# EAGLE design BigBus_Error (EAGLE 7.7.0)
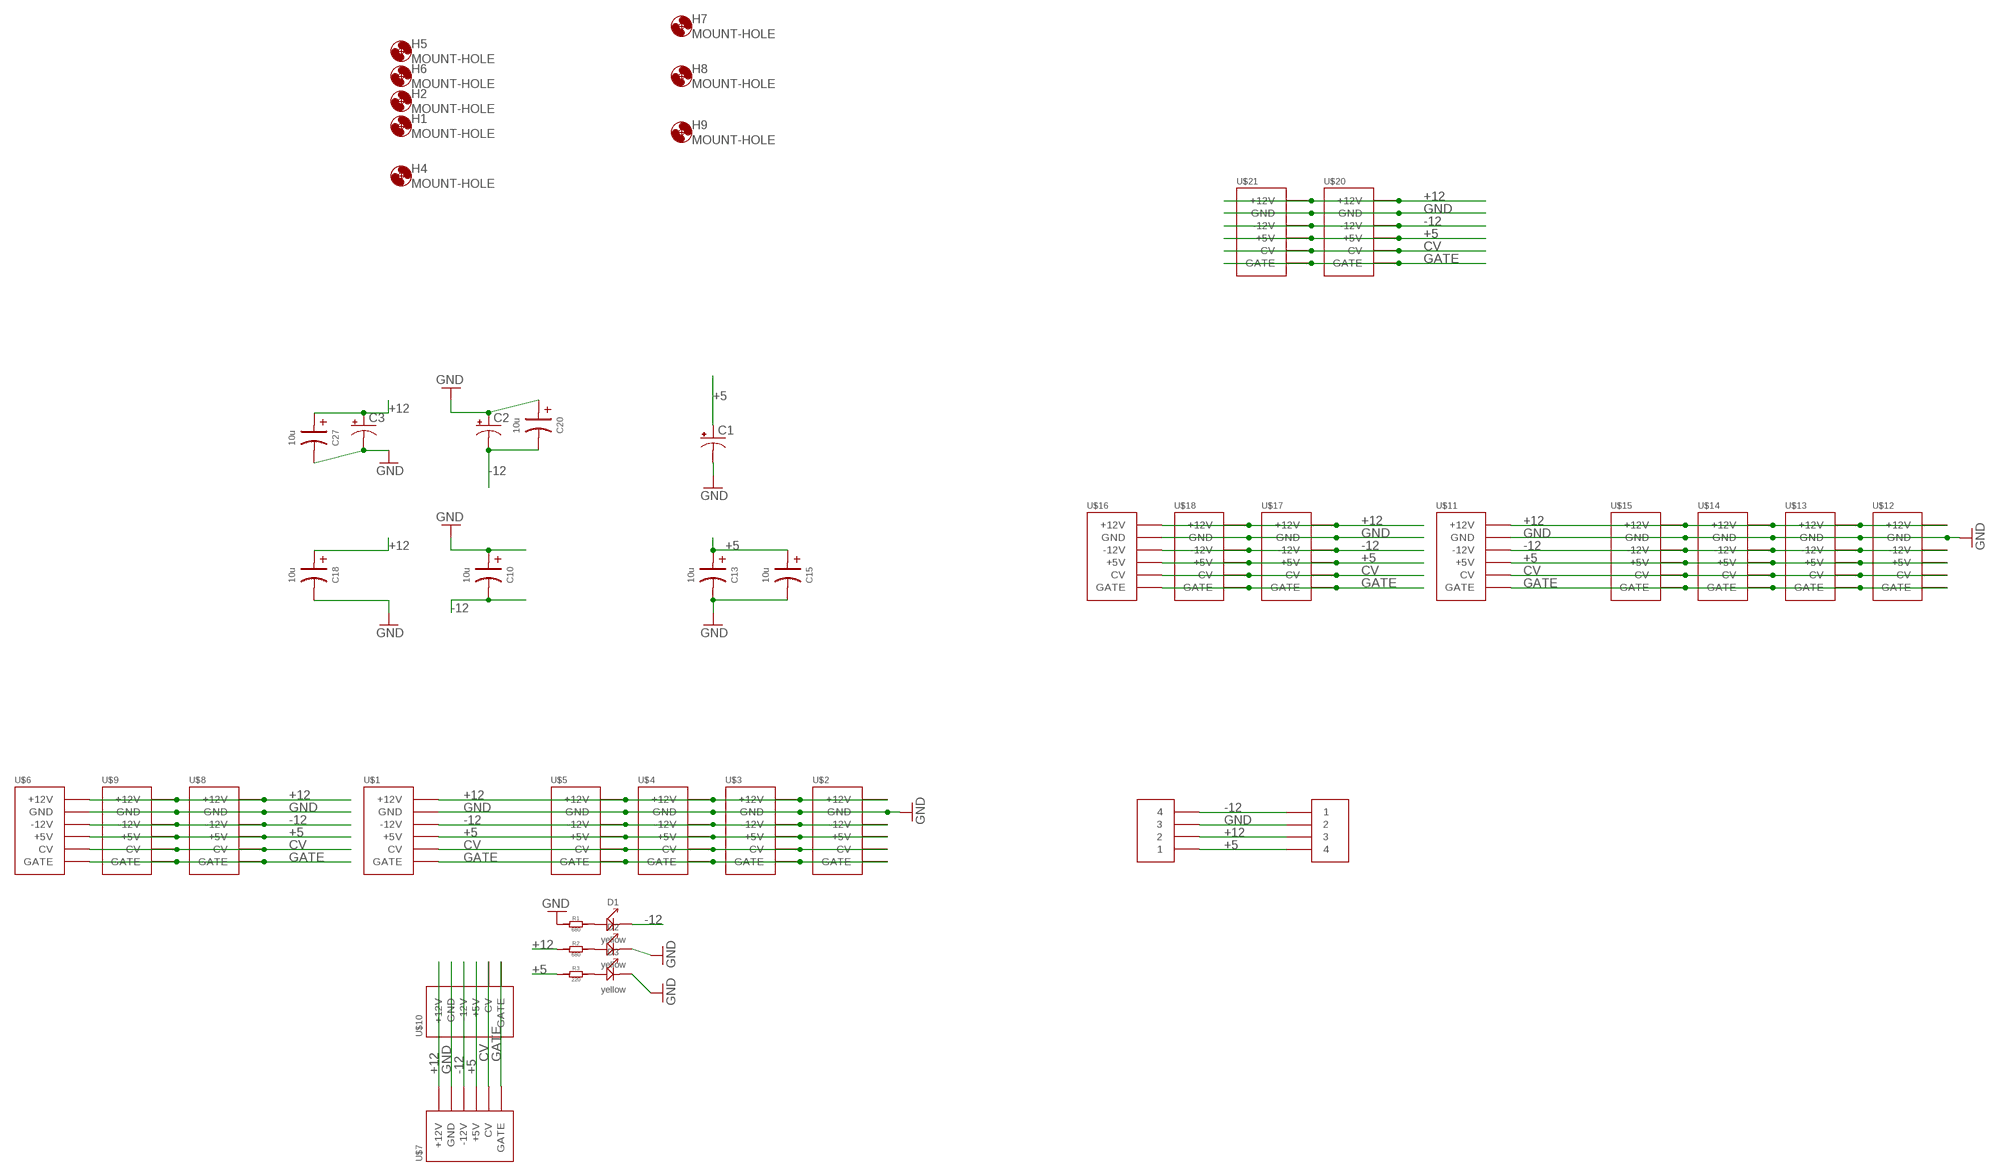
[diagram p0: schematic, sheet 1]

## Parts
C1  CAP_POLD  [PANASONIC_D]
C2  CAP_POLD  [PANASONIC_D]
C3  CAP_POLD  [PANASONIC_D]
C10  10u  C-POLAR-A  [AVX-A]
C13  10u  C-POLAR-A  [AVX-A]
C15  10u  C-POLAR-A  [AVX-A]
C18  10u  C-POLAR-A  [AVX-A]
C20  10u  C-POLAR-A  [AVX-A]
C27  10u  C-POLAR-A  [AVX-A]
D1  yellow  LED  [LED0603]
D2  yellow  LED  [LED0603]
D3  yellow  LED  [LED0603]
H1  MOUNT-HOLE  [3.2-NOMARKINGS-SMALLSAFEZONE]
H2  MOUNT-HOLE  [3.2-NOMARKINGS-SMALLSAFEZONE]
H4  MOUNT-HOLE  [3.2-NOMARKINGS-SMALLSAFEZONE]
H5  MOUNT-HOLE  [3.2-NOMARKINGS-SMALLSAFEZONE]
H6  MOUNT-HOLE  [3.2-NOMARKINGS-SMALLSAFEZONE]
H7  MOUNT-HOLE  [3.2-NOMARKINGS-SMALLSAFEZONE]
H8  MOUNT-HOLE  [3.2-NOMARKINGS-SMALLSAFEZONE]
H9  MOUNT-HOLE  [3.2-NOMARKINGS-SMALLSAFEZONE]
R1  680  R-0603  [R0603]
R2  680  R-0603  [R0603]
R3  220  R-0603  [R0603]
U$1  POWER_SHROUDED_NOTEXT  [POWER_16_SHROUDED_NOTEXT]
U$2  POWER_SHROUDED_NOTEXT  [POWER_16_SHROUDED_NOTEXT]
U$3  POWER_SHROUDED_NOTEXT  [POWER_16_SHROUDED_NOTEXT]
U$4  POWER_SHROUDED_NOTEXT  [POWER_16_SHROUDED_NOTEXT]
U$5  POWER_SHROUDED_NOTEXT  [POWER_16_SHROUDED_NOTEXT]
U$6  POWER_SHROUDED_NOTEXT  [POWER_16_SHROUDED_NOTEXT]
U$7  POWER_SHROUDED_NOTEXT  [POWER_16_SHROUDED_NOTEXT]
U$8  POWER_SHROUDED_NOTEXT  [POWER_16_SHROUDED_NOTEXT]
U$9  POWER_SHROUDED_NOTEXT  [POWER_16_SHROUDED_NOTEXT]
U$10  POWER_SHROUDED_NOTEXT  [POWER_16_SHROUDED_NOTEXT]
U$11  POWER_SHROUDED_NOTEXT  [POWER_16_SHROUDED_NOTEXT]
U$12  POWER_SHROUDED_NOTEXT  [POWER_16_SHROUDED_NOTEXT]
U$13  POWER_SHROUDED_NOTEXT  [POWER_16_SHROUDED_NOTEXT]
U$14  POWER_SHROUDED_NOTEXT  [POWER_16_SHROUDED_NOTEXT]
U$15  POWER_SHROUDED_NOTEXT  [POWER_16_SHROUDED_NOTEXT]
U$16  POWER_SHROUDED_NOTEXT  [POWER_16_SHROUDED_NOTEXT]
U$17  POWER_SHROUDED_NOTEXT  [POWER_16_SHROUDED_NOTEXT]
U$18  POWER_SHROUDED_NOTEXT  [POWER_16_SHROUDED_NOTEXT]
U$19  4PIN5MM  [4PIN5MM]
U$20  POWER_SHROUDED_NOTEXT  [POWER_16_SHROUDED_NOTEXT]
U$21  POWER_SHROUDED_NOTEXT  [POWER_16_SHROUDED_NOTEXT]
U$22  4PIN5MM  [4PIN5MM]

## Nets
+5: C1.+ C13.+ C15.+ R3.1 U$1.11(+5V) U$1.12(+5V) U$2.11(+5V) U$2.12(+5V) U$3.11(+5V) U$3.12(+5V) U$4.11(+5V) U$4.12(+5V) U$5.11(+5V) U$5.12(+5V) U$6.11(+5V) U$6.12(+5V) U$7.11(+5V) U$7.12(+5V) U$8.11(+5V) U$8.12(+5V) U$9.11(+5V) U$9.12(+5V) U$10.11(+5V) U$10.12(+5V) U$11.11(+5V) U$11.12(+5V) U$12.11(+5V) U$12.12(+5V) U$13.11(+5V) U$13.12(+5V) U$14.11(+5V) U$14.12(+5V) U$15.11(+5V) U$15.12(+5V) U$16.11(+5V) U$16.12(+5V) U$17.11(+5V) U$17.12(+5V) U$18.11(+5V) U$18.12(+5V) U$19.4 U$20.11(+5V) U$20.12(+5V) U$21.11(+5V) U$21.12(+5V) U$22.1
+12: C3.+ C18.+ C27.+ R2.1 U$1.9(+12V) U$1.10(+12V) U$2.9(+12V) U$2.10(+12V) U$3.9(+12V) U$3.10(+12V) U$4.9(+12V) U$4.10(+12V) U$5.9(+12V) U$5.10(+12V) U$6.9(+12V) U$6.10(+12V) U$7.9(+12V) U$7.10(+12V) U$8.9(+12V) U$8.10(+12V) U$9.9(+12V) U$9.10(+12V) U$10.9(+12V) U$10.10(+12V) U$11.9(+12V) U$11.10(+12V) U$12.9(+12V) U$12.10(+12V) U$13.9(+12V) U$13.10(+12V) U$14.9(+12V) U$14.10(+12V) U$15.9(+12V) U$15.10(+12V) U$16.9(+12V) U$16.10(+12V) U$17.9(+12V) U$17.10(+12V) U$18.9(+12V) U$18.10(+12V) U$19.3 U$20.9(+12V) U$20.10(+12V) U$21.9(+12V) U$21.10(+12V) U$22.2
-12: C2.- C10.- C20.- D1.- U$1.1(-12V) U$1.2(-12V) U$2.1(-12V) U$2.2(-12V) U$3.1(-12V) U$3.2(-12V) U$4.1(-12V) U$4.2(-12V) U$5.1(-12V) U$5.2(-12V) U$6.1(-12V) U$6.2(-12V) U$7.1(-12V) U$7.2(-12V) U$8.1(-12V) U$8.2(-12V) U$9.1(-12V) U$9.2(-12V) U$10.1(-12V) U$10.2(-12V) U$11.1(-12V) U$11.2(-12V) U$12.1(-12V) U$12.2(-12V) U$13.1(-12V) U$13.2(-12V) U$14.1(-12V) U$14.2(-12V) U$15.1(-12V) U$15.2(-12V) U$16.1(-12V) U$16.2(-12V) U$17.1(-12V) U$17.2(-12V) U$18.1(-12V) U$18.2(-12V) U$19.1 U$20.1(-12V) U$20.2(-12V) U$21.1(-12V) U$21.2(-12V) U$22.4
CV: U$1.13(CV) U$1.14(CV) U$2.13(CV) U$2.14(CV) U$3.13(CV) U$3.14(CV) U$4.13(CV) U$4.14(CV) U$5.13(CV) U$5.14(CV) U$6.13(CV) U$6.14(CV) U$7.13(CV) U$7.14(CV) U$8.13(CV) U$8.14(CV) U$9.13(CV) U$9.14(CV) U$10.13(CV) U$10.14(CV) U$11.13(CV) U$11.14(CV) U$12.13(CV) U$12.14(CV) U$13.13(CV) U$13.14(CV) U$14.13(CV) U$14.14(CV) U$15.13(CV) U$15.14(CV) U$16.13(CV) U$16.14(CV) U$17.13(CV) U$17.14(CV) U$18.13(CV) U$18.14(CV) U$20.13(CV) U$20.14(CV) U$21.13(CV) U$21.14(CV)
GATE: U$1.15(GATE) U$1.16(GATE) U$2.15(GATE) U$2.16(GATE) U$3.15(GATE) U$3.16(GATE) U$4.15(GATE) U$4.16(GATE) U$5.15(GATE) U$5.16(GATE) U$6.15(GATE) U$6.16(GATE) U$7.15(GATE) U$7.16(GATE) U$8.15(GATE) U$8.16(GATE) U$9.15(GATE) U$9.16(GATE) U$10.15(GATE) U$10.16(GATE) U$11.15(GATE) U$11.16(GATE) U$12.15(GATE) U$12.16(GATE) U$13.15(GATE) U$13.16(GATE) U$14.15(GATE) U$14.16(GATE) U$15.15(GATE) U$15.16(GATE) U$16.15(GATE) U$16.16(GATE) U$17.15(GATE) U$17.16(GATE) U$18.15(GATE) U$18.16(GATE) U$20.15(GATE) U$20.16(GATE) U$21.15(GATE) U$21.16(GATE)
GND: C1.- C2.+ C3.- C10.+ C13.- C15.- C18.- C20.+ C27.- D2.- D3.- R1.1 U$1.3(GND) U$1.4(GND) U$1.5(GND) U$1.6(GND) U$1.7(GND) U$1.8(GND) U$2.3(GND) U$2.4(GND) U$2.5(GND) U$2.6(GND) U$2.7(GND) U$2.8(GND) U$3.3(GND) U$3.4(GND) U$3.5(GND) U$3.6(GND) U$3.7(GND) U$3.8(GND) U$4.3(GND) U$4.4(GND) U$4.5(GND) U$4.6(GND) U$4.7(GND) U$4.8(GND) U$5.3(GND) U$5.4(GND) U$5.5(GND) U$5.6(GND) U$5.7(GND) U$5.8(GND) U$6.3(GND) U$6.4(GND) U$6.5(GND) U$6.6(GND) U$6.7(GND) U$6.8(GND) U$7.3(GND) U$7.4(GND) U$7.5(GND) U$7.6(GND) U$7.7(GND) U$7.8(GND) U$8.3(GND) U$8.4(GND) U$8.5(GND) U$8.6(GND) U$8.7(GND) U$8.8(GND) U$9.3(GND) U$9.4(GND) U$9.5(GND) U$9.6(GND) U$9.7(GND) U$9.8(GND) U$10.3(GND) U$10.4(GND) U$10.5(GND) U$10.6(GND) U$10.7(GND) U$10.8(GND) U$11.3(GND) U$11.4(GND) U$11.5(GND) U$11.6(GND) U$11.7(GND) U$11.8(GND) U$12.3(GND) U$12.4(GND) U$12.5(GND) U$12.6(GND) U$12.7(GND) U$12.8(GND) U$13.3(GND) U$13.4(GND) U$13.5(GND) U$13.6(GND) U$13.7(GND) U$13.8(GND) U$14.3(GND) U$14.4(GND) U$14.5(GND) U$14.6(GND) U$14.7(GND) U$14.8(GND) U$15.3(GND) U$15.4(GND) U$15.5(GND) U$15.6(GND) U$15.7(GND) U$15.8(GND) U$16.3(GND) U$16.4(GND) U$16.5(GND) U$16.6(GND) U$16.7(GND) U$16.8(GND) U$17.3(GND) U$17.4(GND) U$17.5(GND) U$17.6(GND) U$17.7(GND) U$17.8(GND) U$18.3(GND) U$18.4(GND) U$18.5(GND) U$18.6(GND) U$18.7(GND) U$18.8(GND) U$19.2 U$20.3(GND) U$20.4(GND) U$20.5(GND) U$20.6(GND) U$20.7(GND) U$20.8(GND) U$21.3(GND) U$21.4(GND) U$21.5(GND) U$21.6(GND) U$21.7(GND) U$21.8(GND) U$22.3
N$1: D1.+ R1.2
N$2: D2.+ R2.2
N$3: D3.+ R3.2

## Library data of the parts
C1-C3 = SparkFun-Capacitors:CAP_POL: Capacitor Polarized These are standard SMD and PTH capacitors. Normally 10uF, 47uF, and 100uF in electrolytic and tantalum varieties. Always verify the external diameter of the through hole cap, it varies with capacity, voltage, and manufacturer. The EIA devices should be standard.
C10 C13 C15 C18 C20 C27 = EurorackModularParts:C-POLAR*
D1-D3 = OPL:LED*: LED
H1 H2 H4-H9 = zephod-components:MOUNT-HOLE: MOUNTING HOLE with drill center marker
R1-R3 = OPL:R*
U$1-U$18 U$20 U$21 = EurorackModularParts:POWER
U$19 U$22 = EurorackModularParts:4PIN5MM

## Net classes
0 default: width 0.254 mm
1 Powertrace: width 1.87 mm

## Board
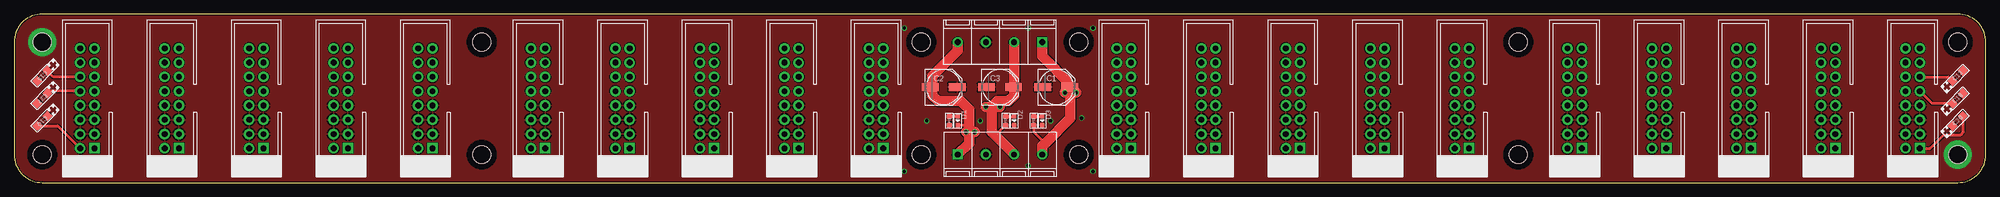
[diagram p1: board, top side]
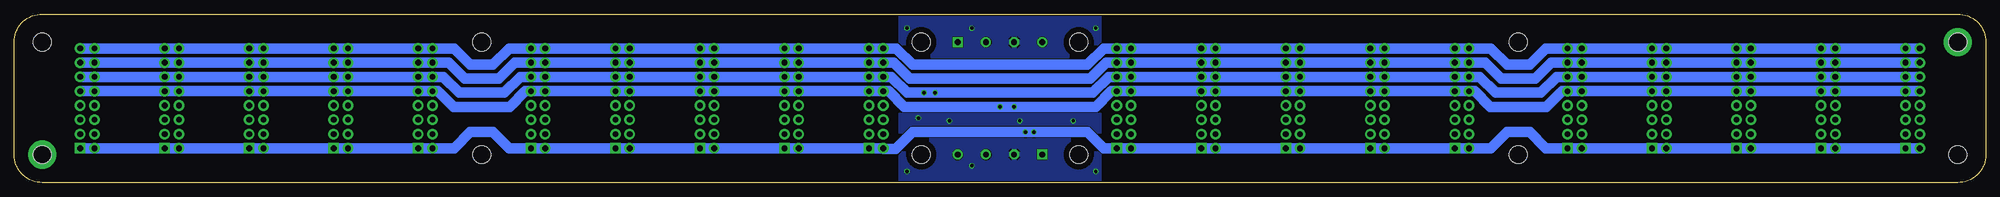
[diagram p2: board, bottom side, seen from below]

Size 350 x 30 mm. Coordinates in mm from the lower left corner, seen from the top.
Outline: 0,25 0,5 arc90 5,0 345,0 arc90 350,5 350,25 arc90 345,30 5,30 arc90 0,25
Copper layers (1*16): Top 0.035mm / dielectric 1.5mm / Bottom 0.035mm
Design rules "dirt_cheap_dirty_boards.v1": minimum track width 5mil, minimum drill 12mil, track to track 5mil, track to pad 5mil, pad to pad 5mil, via to via 5mil, smd to smd 0mil, copper to edge 10mil, drill to drill 10mil, minimum pad ring 10mil, minimum via ring 6mil, stop-mask expansion 2mil, vias tented up to drill 25mil, thermal gap 10mil
Holes 3.2 mm at 5,25 345,5

### Footprints (pad centres in the part's own frame; a part is rotated, then mirrored left to right if it is on the bottom)
PANASONIC_D = smd 3 x 1.4: + 2.4,0; - -2.4,0
AVX-A = smd 1.27 x 1.27: + -1.27,0; - 1.27,0
LED0603 = smd 0.762 x 0.889: + -0.762,0; - 0.762,0
3.2-NOMARKINGS-SMALLSAFEZONE = hole 3.2: 0,0
R0603 = smd 0.889 x 0.889: 1 -0.762,0; 2 0.762,0
POWER_16_SHROUDED_NOTEXT = drill 1.016 pad 1.88 square: 1 -8.89,-1.27 | drill 1.016 pad 1.88: 2 -8.89,1.27; 3 -6.35,-1.27; 4 -6.35,1.27; 5 -3.81,-1.27; 6 -3.81,1.27; 7 -1.27,-1.27; 8 -1.27,1.27; 9 1.27,-1.27; 10 1.27,1.27; 11 3.81,-1.27; 12 3.81,1.27; 13 6.35,-1.27; 14 6.35,1.27; 15 8.89,-1.27; 16 8.89,1.27
4PIN5MM = drill 1.016 pad 1.778 square: 1 -7.5,0 | drill 1.016 pad 1.778: 2 -2.5,0; 3 2.5,0; 4 7.5,0

### Placement (x,y rotation side)
C1  185,17 0 top
C2  165,17 0 top
C3  175,17 0 top
C10  5,11 225 top
C13  345,19 45 top
C15  5,19 225 top
C18  345,15 45 top
C20  345,11 45 top
C27  5,15 225 top
D1  167.5,11 270 top
D2  177.5,11 270 top
D3  182.5,11 270 top
H1  5,5 0 top
H2  267,5 0 top
H4  267,25 0 top
H5  161,25 0 top
H6  161,5 0 top
H7  83,25 0 top
H8  83,5 0 top
H9  345,25 0 top
H11  MOUNT-HOLE  [3.2-NOMARKINGS-SMALLSAFEZONE]  189,25 0 top
H12  MOUNT-HOLE  [3.2-NOMARKINGS-SMALLSAFEZONE]  189,5 0 top
R1  166,11 90 top
R2  176,11 90 top
R3  181,11 90 top
U$1  58,15 90 top
U$2  73,15 90 top
U$3  93,15 90 top
U$4  108,15 90 top
U$5  123,15 90 top
U$6  43,15 90 top
U$7  153,15 90 top
U$8  28,15 90 top
U$9  13,15 90 top
U$10  197,15 90 top
U$11  138,15 90 top
U$12  307,15 90 top
U$13  212,15 90 top
U$14  292,15 90 top
U$15  227,15 90 top
U$16  277,15 90 top
U$17  242,15 90 top
U$18  257,15 90 top
U$19  175,5 0 top
U$20  322,15 90 top
U$21  337,15 90 top
U$22  175,25 180 top

### Tracks (layer width: path | path; a pad name or v marks a point on that pad's centre or on a via)
+5  (via drill 0.61)
  Top 0.508: R3.1 181,9 183,7 | v186.5,16 187.4,16.9 C1.+ 187.4,16.6 187.5,16.5 | U$9.12 6.99,18.81 C15.+ | U$21.11 343.39,18.81 C13.+
  Top 1.87: U$22.1 182.5,22.5 187.5,17.5 187.5,16.5 187.5,11.5 183,7 182.5,6.5 U$19.4 | v188.5,16 v186.5,16
  Bottom 1.87: U$21.11 U$21.12 U$20.11 U$20.12 U$12.11 U$12.12 U$14.11 U$14.12 U$16.11 U$16.12 | U$18.11 U$18.12 U$17.11 U$17.12 U$15.11 U$15.12 U$13.11 U$13.12 U$10.11 U$10.12 194.31,18.81 191.5,16 v188.5,16 v186.5,16 158.5,16 155.69,18.81 U$7.11 U$7.12 U$11.11 U$11.12 U$5.11 U$5.12 U$4.11 U$4.12 U$3.11 92.5,18.81 U$3.12 | U$9.12 U$9.11 U$8.12 U$8.11 U$6.12 U$6.11 U$1.12 U$1.11 U$2.12 U$2.11
  Bottom 1.88: U$2.11 76.19,18.81 79,16 87,16 89.81,18.81 92.5,18.81 | U$18.11 260.19,18.81 263,16 271,16 273.81,18.81 U$16.12
+12  (via drill 0.61)
  Top 0.508: 173.5,9 174.76,9 R2.1 | C3.+ 177.4,16.1 177.5,16 | U$9.10 6.27,16.27 C27.+ | C18.+ 340.44,14.1 U$21.9
  Top 1.87: U$22.2 177.5,16 177.5,15.5 176.5,14.5 174.5,14.5 173.5,13.5 | 173.5,13.5 173.5,9 U$19.3 | 173.5,13.5 v172.5,13.5 v175,13.5
  Bottom 1.87: U$21.9 U$21.10 U$20.9 U$20.10 U$12.9 U$12.10 U$14.9 U$14.10 U$16.9 U$16.10 | U$18.9 U$18.10 U$17.9 U$17.10 U$15.9 U$15.10 U$13.9 U$13.10 U$10.9 U$10.10 194.77,16.27 192,13.5 v175,13.5 v172.5,13.5 158,13.5 155.23,16.27 U$7.9 U$7.10 U$11.9 U$11.10 U$5.9 U$5.10 U$4.9 U$4.10 U$3.9 U$3.10 | U$9.10 U$9.9 U$8.10 U$8.9 U$6.10 U$6.9 U$1.10 U$1.9 U$2.10 U$2.9
  Bottom 1.88: U$2.9 75.23,16.27 78,13.5 88,13.5 90.77,16.27 U$3.10 | U$18.9 259.23,16.27 262,13.5 272,13.5 274.77,16.27 U$16.10
-12  (via drill 0.61)
  Top 0.508: D1.- 169,10.24 | 169,10.24 169.24,10.24 169.5,10.5 | v169,9 169,10.24 | C10.- 7.74,10.1 U$9.2 | U$21.1 340.11,6.11 342.5,8.5 345.5,8.5 346,9 346,11.8 C20.- | 163,15.5 163,16.6 C2.-
  Top 1.87: U$22.4 167.5,23.5 163,19 163,15.5 164,14.5 168,14.5 169.5,13 169.5,10.5 169.5,7 U$19.1 | v169,9 v170.5,9
  Bottom 1: 195.62,6 U$10.2
  Bottom 1.87: U$16.2 U$16.1 U$14.2 U$14.1 U$12.2 U$12.1 U$20.2 U$20.1 U$21.2 U$21.1 | U$18.1 U$18.2 U$17.1 U$17.2 U$15.1 U$15.2 U$13.1 U$13.2 U$10.1 U$10.2 | U$2.1 U$2.2 U$1.1 U$1.2 U$6.1 U$6.2 U$8.1 U$8.2 U$9.1 U$9.2 | U$3.2 U$3.1 U$4.2 U$4.1 U$5.2 U$5.1 U$11.2 U$11.1 U$7.2 U$7.1 156.61,6.11 159.5,9 v169,9 v170.5,9 190.5,9 193.5,6 195.62,6
  Bottom 1.88: U$2.1 78.11,6.11 81,9 85,9 87.89,6.11 U$3.2 | U$18.1 262.11,6.11 265,9 269,9 271.89,6.11 U$16.2
CV
  Bottom 1.87: U$9.14 U$9.13 U$8.14 U$8.13 U$6.14 U$6.13 U$1.14 U$1.13 U$2.14 U$2.13 | U$21.13 U$21.14 U$20.13 U$20.14 U$12.13 U$12.14 U$14.13 U$14.14 U$16.13 U$16.14 | U$18.13 U$18.14 U$17.13 U$17.14 U$15.13 U$15.14 U$13.13 U$13.14 U$10.13 U$10.14 193.85,21.35 191,18.5 159,18.5 156.15,21.35 U$7.13 U$7.14 U$11.13 U$11.14 U$5.13 U$5.14 U$4.13 U$4.14 U$3.13 92.5,21.35 U$3.14
  Bottom 1.88: U$2.13 77.15,21.35 80,18.5 86,18.5 88.85,21.35 92.5,21.35 | U$18.13 261.15,21.35 264,18.5 270,18.5 272.85,21.35 U$16.14
GATE
  Bottom 1.87: U$9.16 U$9.15 U$8.16 U$8.15 U$6.16 U$6.15 U$1.16 U$1.15 U$2.16 U$2.15 | U$18.15 U$18.16 U$17.15 U$17.16 U$15.15 U$15.16 U$13.15 U$13.16 U$10.15 U$10.16 193.39,23.89 190.5,21 159.5,21 156.61,23.89 U$7.15 U$7.16 U$11.15 U$11.16 U$5.15 U$5.16 U$4.15 U$4.16 U$3.15 U$3.16 | U$16.16 276.5,23.89 U$16.15 U$14.16 U$14.15 U$12.16 U$12.15 U$20.16 U$20.15 U$21.16 U$21.15
  Bottom 1.88: U$2.15 78.11,23.89 81,21 85,21 87.89,23.89 U$3.16 | U$18.15 262.11,23.89 265,21 269,21 271.89,23.89 276.5,23.89
GND  (via drill 0.61, 3.2 pad 5)
  other vias: 158,27.5 162,11 158,2 171.5,11 184,11 189.5,11.5 191.5,27.5 180,27.5 180,3 191.5,2 5,25 345,5
  pour Top: 0,31 345,30 arc-90 350,25 350,0 5,0 arc-90 0,5
  pour Bottom: 157.5,30 192.5,30 192.5,0 157.5,0
N$1
  Top 0.508: D1.+ R1.2
N$2
  Top 0.508: R2.2 D2.+
N$3
  Top 0.508: R3.2 D3.+